# EAGLE schematic projeto (EAGLE 9.6.2)
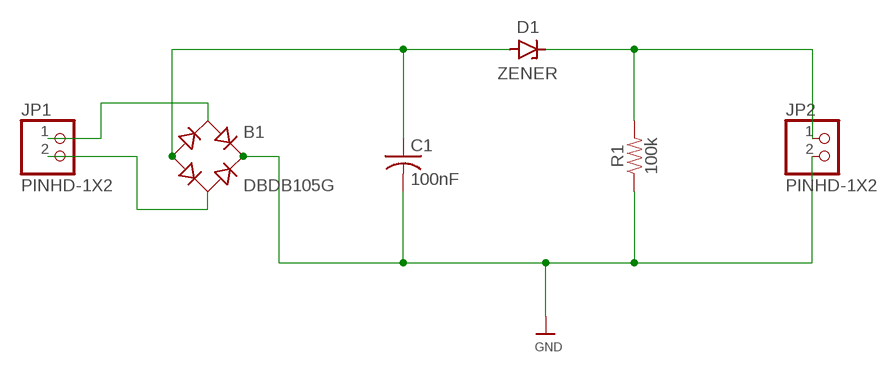
[diagram p0: schematic, sheet 1]

## Parts
B1  DBDB105G  [DB]
C1  100nF  C-US025-025X050  [C025-025X050]
D1  ZENER  ZENERDO-214AA(SMB)  [DIOM5336X265N]
JP1  PINHD-1X2  [1X02]
JP2  PINHD-1X2  [1X02]
R1  100k  0.1OHM-1210-1/2W-1%  [1210]

## Nets
GND: B1.+ C1.2 JP2.2 R1.1
N$1: B1.AC1 JP1.1
N$2: B1.AC2 JP1.2
N$3: B1.- C1.1 D1.2(A)
N$5: D1.1(C) JP2.1 R1.2

## Library data of the parts
B1 = rectifier:DB?*G: Single Phase 1.0 AMP Glass Passivated Bridge Rectifier Taiwan Semiconductor Co.,Ltd. - TSC Source: http://www.taiwansemi.com/TSCbig5/ezcatfiles/cust/img/img/db101g.pdf http://www.ts.com.tw/db/pictures/modules/PDT/PDT060207001/DBLS201G.pdf
C1 = adafruit:C-US: CAPACITOR, American symbol
D1 = Diode:ZENER: Zener Diode - Generic; CATEGORY: Diode; SUB-CATEGORY: Zener
JP1 JP2 = Connector:PINHD-1X2: PIN HEADER; CATEGORY: CONNECTOR; SUB-CATEGORY: PIN-HEADER
R1 = SparkFun-Resistors:0.1OHM: 0.1Ω resistor A resistor is a passive two-terminal electrical component that implements electrical resistance as a circuit element. Resistors act to reduce current flow, and, at the same time, act to lower voltage levels within circuits. - Wikipedia; PROD_ID: RES-12374; VALUE: 0.1